# EAGLE design AudioJack (EAGLE 7.5.0)
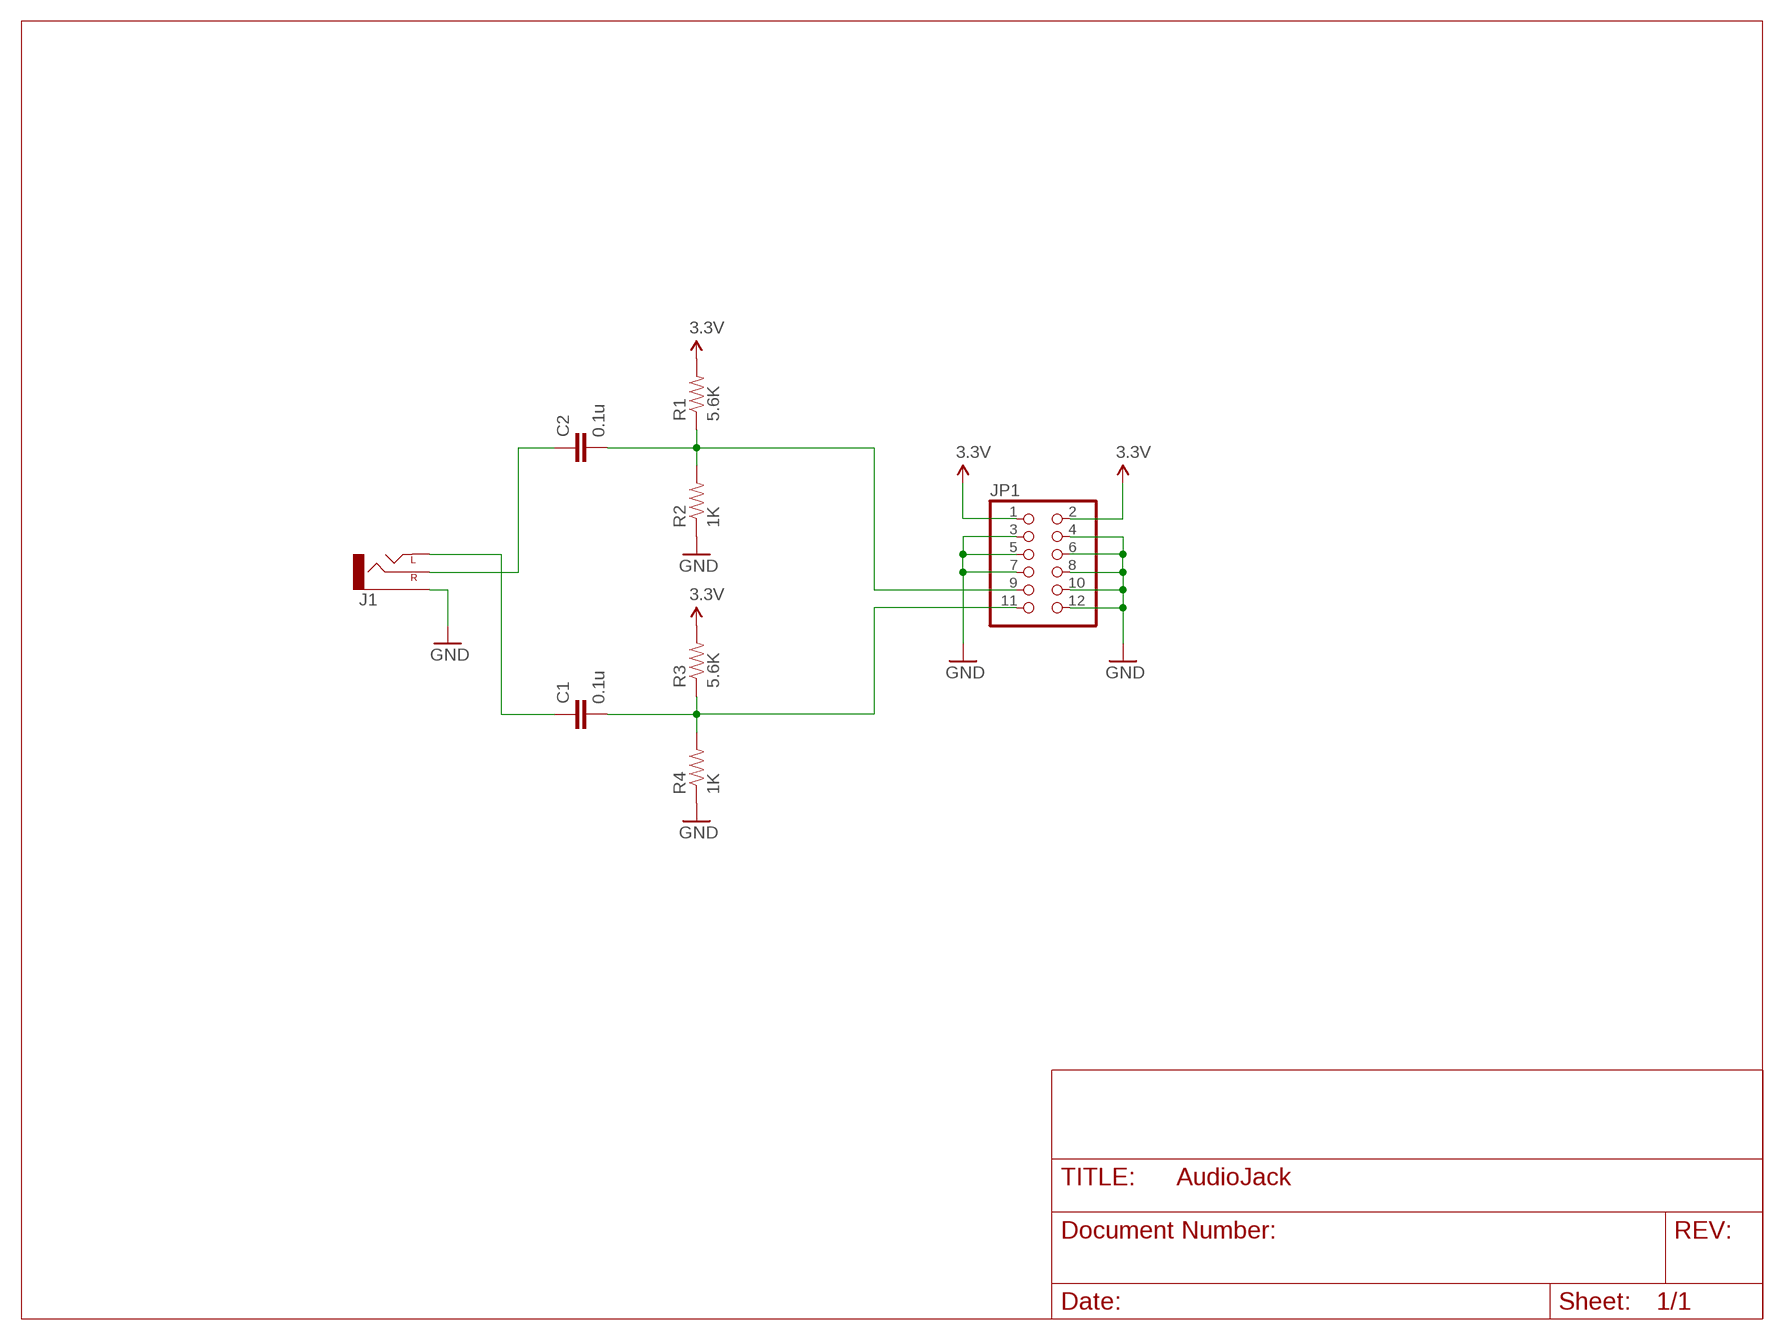
[diagram p0: schematic, sheet 1]

## Parts
C1  0.1u  CAPPTH1  [CAP-PTH-5MM]
C2  0.1u  CAPPTH1  [CAP-PTH-5MM]
J1  AUDIO-JACKPTH  [AUDIO-JACK]
JP1  PINHD-2X6/90  [2X06/90]
R1  5.6K  RESISTORPTH-1/4W  [AXIAL-0.4]
R2  1K  RESISTORPTH-1/4W  [AXIAL-0.4]
R3  5.6K  RESISTORPTH-1/4W  [AXIAL-0.4]
R4  1K  RESISTORPTH-1/4W  [AXIAL-0.4]

## Nets
3.3V: JP1.1 JP1.2 R1.P$2 R3.P$2
GND: J1.SLEEVE JP1.3 JP1.4 JP1.5 JP1.6 JP1.7 JP1.8 JP1.10 JP1.12 R2.P$1 R4.P$1
N$1: C2.1 J1.RING(RIGHT)
N$2: C1.1 J1.TIP(LEFT)
N$3: C2.2 JP1.9 R1.P$1 R2.P$2
N$4: C1.2 JP1.11 R3.P$1 R4.P$2

## Library data of the parts
C1 C2 = SparkFun-Capacitors:CAP: Capacitor Standard 0603 ceramic capacitor, and 0.1" leaded capacitor.
J1 = SparkFun-Connectors:AUDIO-JACK: 3.5mm Audio Jack Simple 3.5mm common PCB mount audio jack. Variant PTH is our storefront SKU PRT-08032
JP1 = pinhead:PINHD-2X6: PIN HEADER
R1-R4 = SparkFun-Resistors:RESISTOR: Resistor Basic schematic elements and footprints for 0603, 1206, and PTH resistors.

## Board
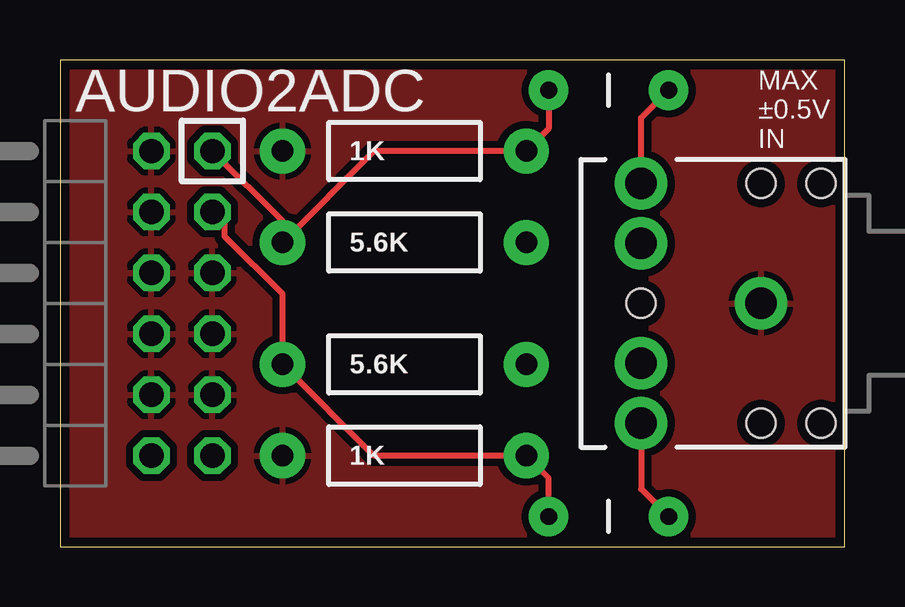
[diagram p1: board, top side]
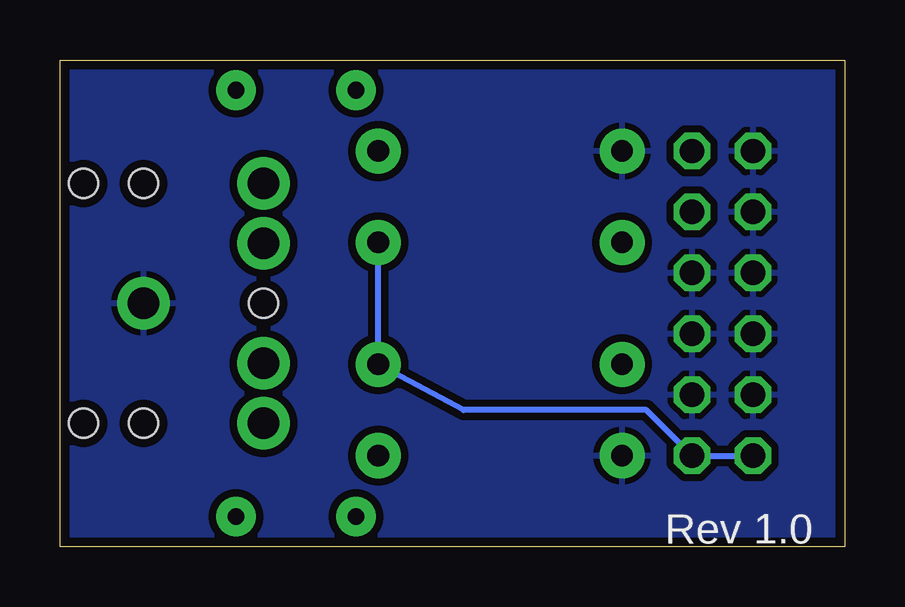
[diagram p2: board, bottom side, seen from below]

Size 32.69 x 20.31 mm. Coordinates in mm from the lower left corner, seen from the top.
Outline: 0,0 32.69,0 32.69,20.31 0,20.31 0,0
Copper layers (1*16): Top 0.0356mm / dielectric 1.5011mm / Bottom 0.0356mm
Design rules "LaenPCBOrder": minimum track width 6mil, minimum drill 13mil, track to track 6mil, track to pad 6mil, pad to pad 6mil, via to via 6mil, smd to smd 6mil, copper to edge 15mil, drill to drill 6mil, minimum pad ring 7mil, minimum via ring 7mil, stop-mask expansion 3mil, vias tented up to drill 0mil, thermal gap 10mil

### Footprints (pad centres in the part's own frame; a part is rotated, then mirrored left to right if it is on the bottom)
CAP-PTH-5MM = drill 0.7 pad 1.651: 1 -2.5,0; 2 2.5,0
AUDIO-JACK = drill 1.3 pad 2.184: RING 5,5; RSH 5,2.5; SLEEVE 0,0; TIP 5,-5; TSH 5,-2.5 | hole 1.2: 0,5; -2.5,5; -2.5,-5; 0,-5; 5,0
2X06/90 = drill 1.016 octagon: 1 -6.35,-6.35; 2 -6.35,-3.81; 3 -3.81,-6.35; 4 -3.81,-3.81; 5 -1.27,-6.35; 6 -1.27,-3.81; 7 1.27,-6.35; 8 1.27,-3.81; 9 3.81,-6.35; 10 3.81,-3.81; 11 6.35,-6.35; 12 6.35,-3.81
AXIAL-0.4 = drill 0.9 pad 1.88: P$1 -5.08,0; P$2 5.08,0

### Placement (x,y rotation side)
C1  22.86,19.05 180 top
C2  22.86,1.27 180 top
J1  29.21,10.16 180 top
JP1  0,10.16 90 top
R1  14.35,7.62 0 top
R2  14.35,3.81 0 top
R3  14.35,12.7 0 top
R4  14.35,16.51 0 top

### Tracks (layer width: path | path; a pad name or v marks a point on that pad's centre or on a via)
3.3V
  Bottom 0.254: JP1.2 JP1.1 8.26,5.71 15.88,5.71 R1.P$2 R3.P$2
GND
  pour Top (isolate 0.305): 0,0 0,20.32 32.64,20.32 32.64,0
  pour Bottom (isolate 0.305): 0,0 0,20.32 32.64,20.32 32.64,0
N$1
  Top 0.254: J1.RING 24.21,2.42 C2.1
N$2
  Top 0.254: J1.TIP 24.21,17.9 C1.1
N$3
  Top 0.254: C2.2 20.36,2.88 R2.P$2 13.08,3.81 R1.P$1 9.27,10.54 6.86,12.95 6.86,13.46 JP1.9
N$4
  Top 0.254: C1.2 20.36,17.44 R4.P$2 13.08,16.51 R3.P$1 9.27,13.59 JP1.11

### Text on the board
tPlace: AUDIO2ADC | MAX / ±0.5V / IN
bPlace: Rev 1.0